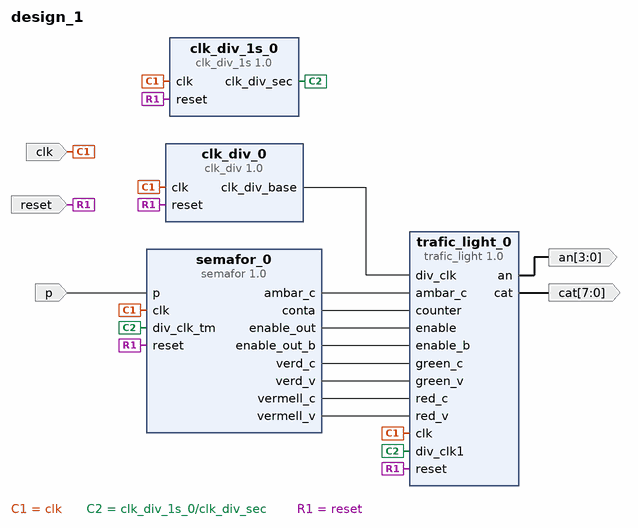
[diagram p0: block diagram of the top level]
# Vivado block design design_1, xc7a35tcpg236-1, Vivado 2022.1
create_bd_design design_1

create_bd_port -dir I -type clk clk
set_property -dict {CONFIG.FREQ_HZ 100000000} [get_bd_ports clk]
create_bd_port -dir I -type rst reset
set_property -dict {CONFIG.POLARITY ACTIVE_HIGH} [get_bd_ports reset]
create_bd_port -dir I p
create_bd_port -dir O -from 7 -to 0 cat
create_bd_port -dir O -from 3 -to 0 an

create_bd_cell -type ip -vlnv xilinx.com:user:clk_div:1.0 clk_div_0
create_bd_cell -type ip -vlnv xilinx.com:user:clk_div_1s:1.0 clk_div_1s_0
create_bd_cell -type ip -vlnv xilinx.com:user:semafor:1.0 semafor_0
create_bd_cell -type ip -vlnv xilinx.com:user:trafic_light:1.0 trafic_light_0

# ---- connections ----

connect_bd_net [get_bd_ports clk] \
  [get_bd_pins clk_div_0/clk] [get_bd_pins clk_div_1s_0/clk] [get_bd_pins semafor_0/clk] [get_bd_pins trafic_light_0/clk]
connect_bd_net -net clk_div_0_clk_div [get_bd_pins clk_div_0/clk_div_base] [get_bd_pins trafic_light_0/div_clk]
connect_bd_net -net clk_div_1s_0_clk_div [get_bd_pins clk_div_1s_0/clk_div_sec] \
  [get_bd_pins semafor_0/div_clk_tm] [get_bd_pins trafic_light_0/div_clk1]
connect_bd_net [get_bd_ports p] [get_bd_pins semafor_0/p]
connect_bd_net [get_bd_ports reset] \
  [get_bd_pins clk_div_0/reset] [get_bd_pins clk_div_1s_0/reset] [get_bd_pins semafor_0/reset] \
  [get_bd_pins trafic_light_0/reset]
connect_bd_net [get_bd_pins semafor_0/ambar_c] [get_bd_pins trafic_light_0/ambar_c]
connect_bd_net [get_bd_pins semafor_0/conta] [get_bd_pins trafic_light_0/counter]
connect_bd_net [get_bd_pins semafor_0/enable_out] [get_bd_pins trafic_light_0/enable]
connect_bd_net [get_bd_pins semafor_0/enable_out_b] [get_bd_pins trafic_light_0/enable_b]
connect_bd_net [get_bd_pins semafor_0/verd_c] [get_bd_pins trafic_light_0/green_c]
connect_bd_net [get_bd_pins semafor_0/verd_v] [get_bd_pins trafic_light_0/green_v]
connect_bd_net [get_bd_pins semafor_0/vermell_c] [get_bd_pins trafic_light_0/red_c]
connect_bd_net [get_bd_pins semafor_0/vermell_v] [get_bd_pins trafic_light_0/red_v]
connect_bd_net [get_bd_pins trafic_light_0/an] [get_bd_ports an]
connect_bd_net [get_bd_pins trafic_light_0/cat] [get_bd_ports cat]

validate_bd_design
save_bd_design
